# Altium schematic sheet CONNECTER.SchDoc
size 420 x 297 mm; SheetNumber: 4; SheetTotal: 4
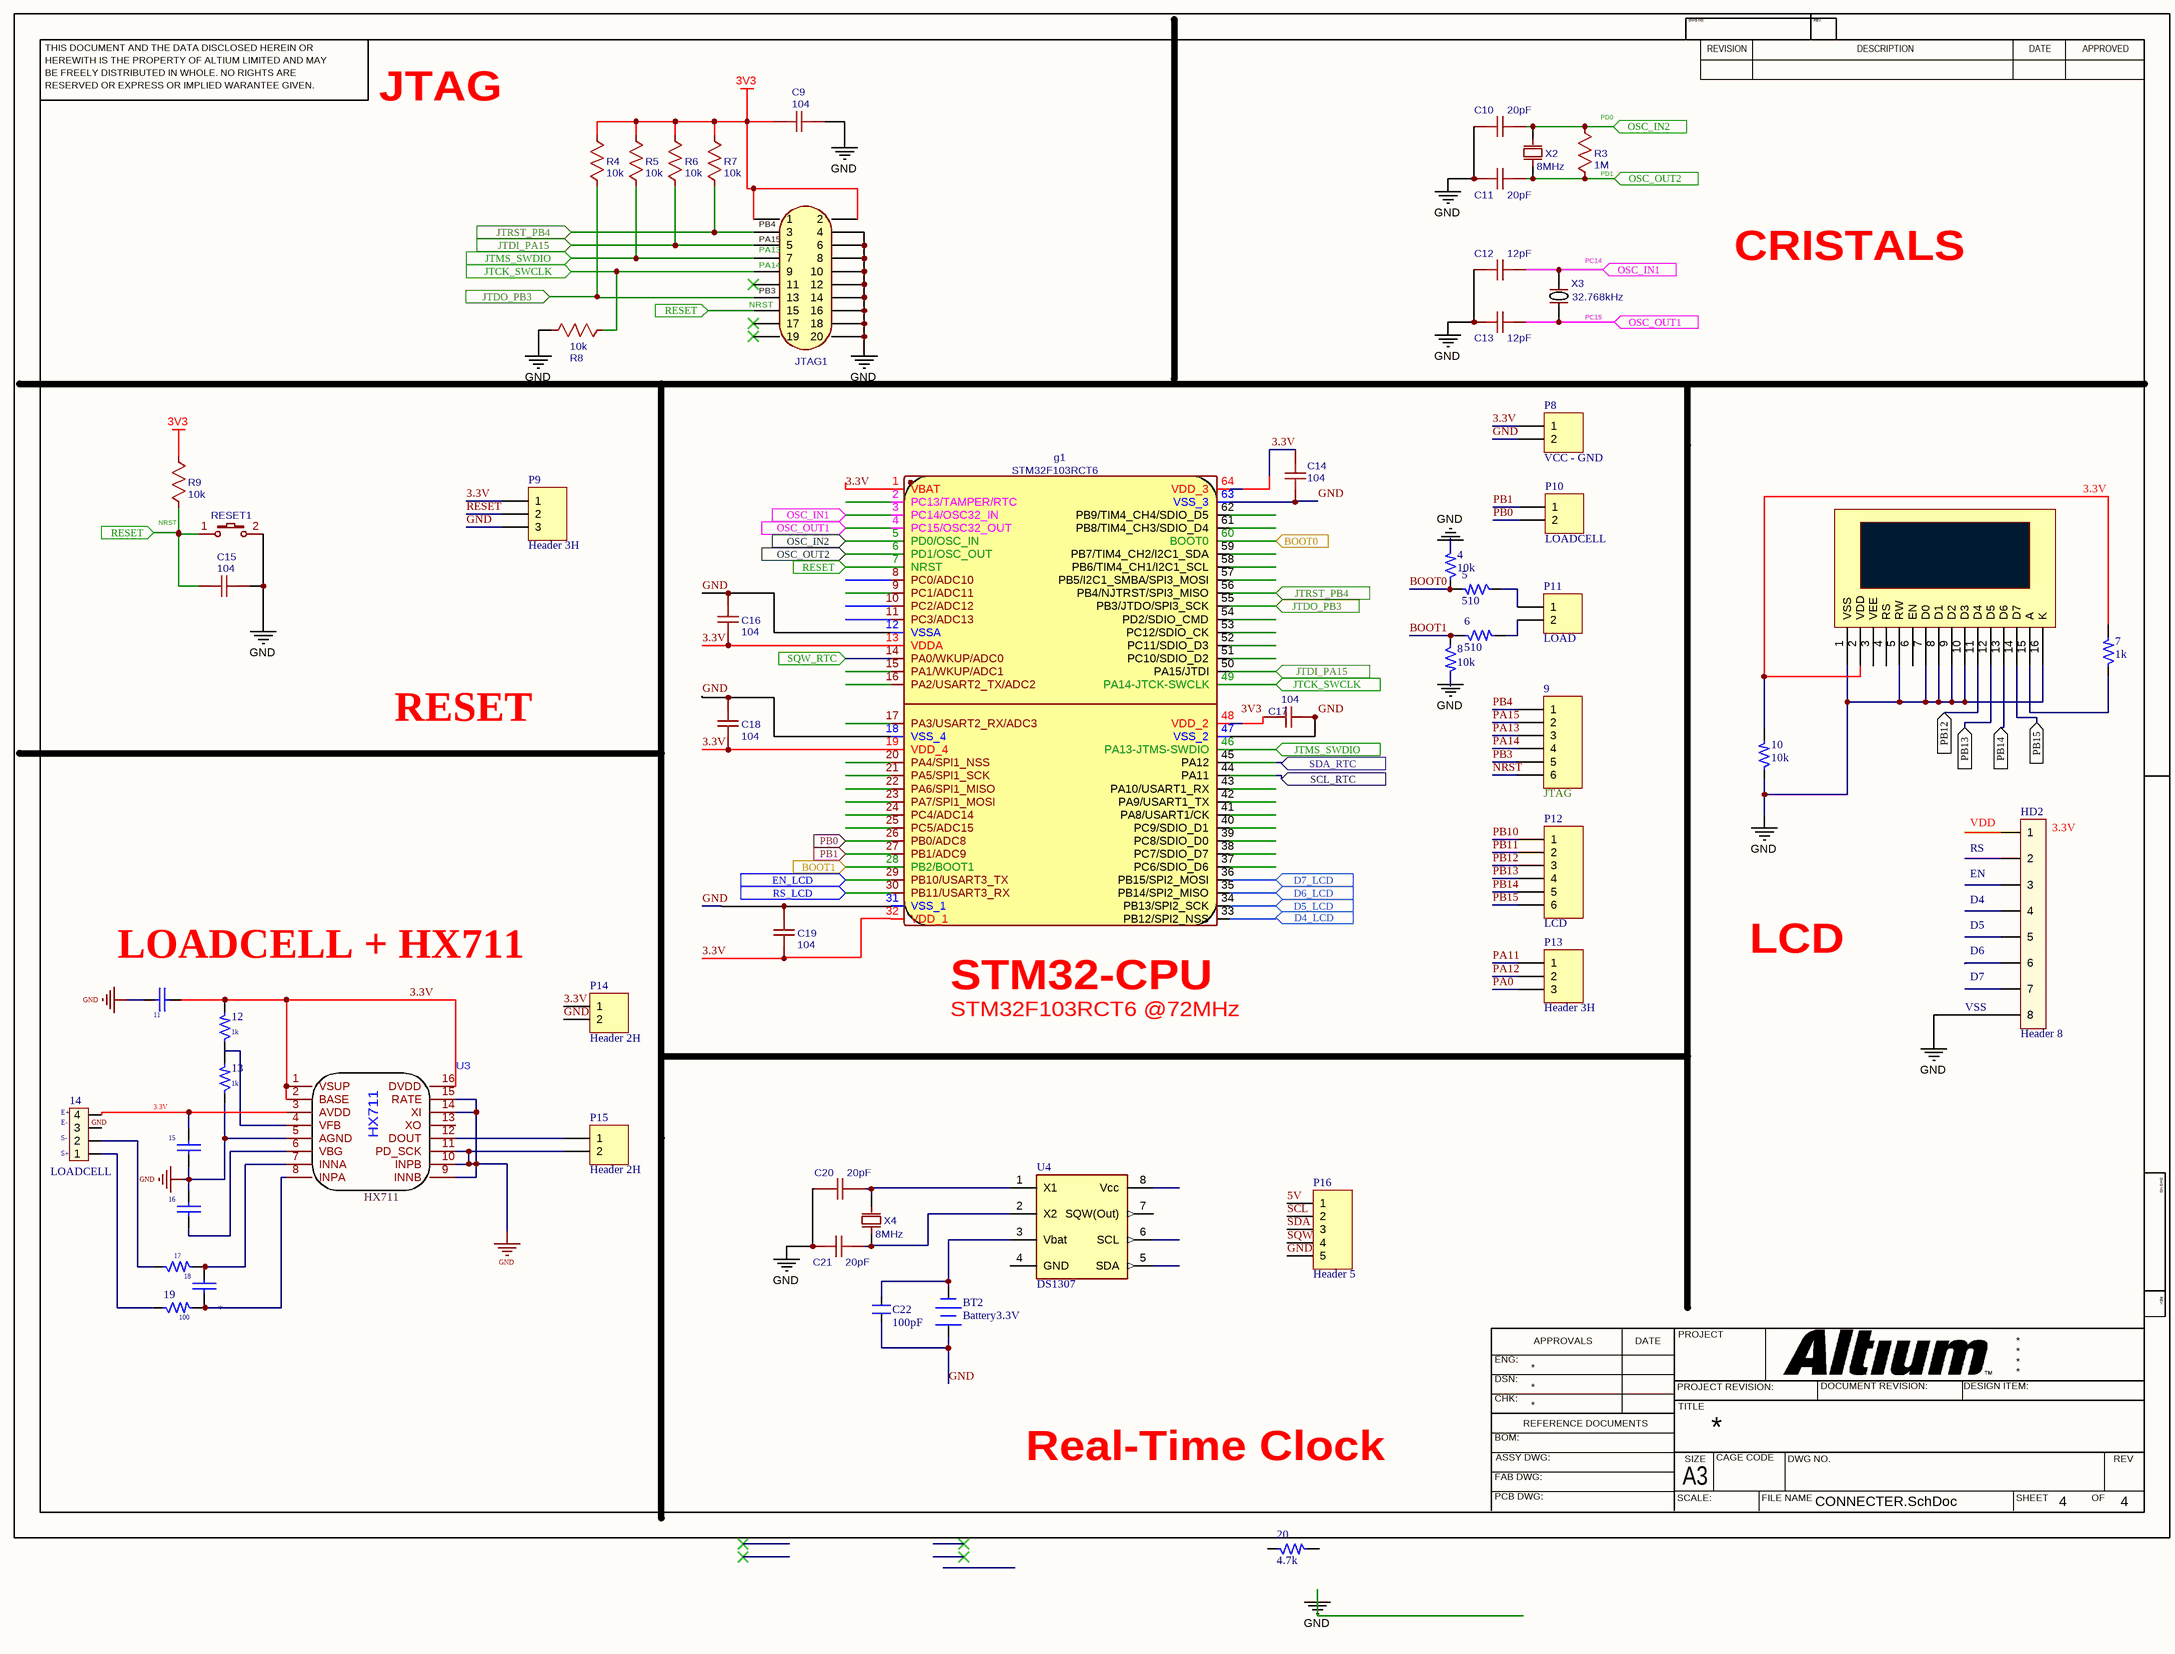
[diagram p0: CONNECTER.SchDoc]

## Parts
4  10k  [R1/6W]
5  510  [R1/6W]
6  510  [R1/6W]
7  1k  [R1/6W]
8  10k  [R1/6W]
9  JTAG  [HDR1X6]
10  10k  [R1/6W]
11  (no value)  [R1206]
12  1k  [R1/6W]
13  1k  [R1/6W]
14  LOADCELL  [JP4]
15  (no value)  [R1206]
16  (no value)  [R1206]
17  100  [R1/6W]
18  (no value)  [R1206]
19  (no value)  [R1/6W]
20  4.7k  [R1/6W]
?  LCD  [LCD16X2]  (value not drawn)
BT2  Battery3.3V  [CR2032 Holder]
C9  104  [C0603]
C10  20pF  [C0603]
C11  20pF  [C0603]
C12  12pF  [C0603]
C13  12pF  [C0603]
C14  104  [C0603]
C15  104  [C0603]
C16  104  [C0603]
C17  104  [C0603]
C18  104  [C0603]
C19  104  [C0603]
C20  20pF  [C0603]
C21  20pF  [C0603]
C22  100pF  [CN1]
g1  STM32F103RCT6  [STM32F103RCT6]
HD2  Header 8  [HED8V]
JTAG1  (no value)  [JTAG]
P8  VCC - GND  [HDR1X2H]
P9  Header 3H  [HDR1X3H]
P10  LOADCELL  [HDR1X2H]
P11  LOAD  [HDR1X2H]
P12  LCD  [HDR1X6]
P13  Header 3H  [HDR1X3H]
P14  Header 2H  [HDR1X2H]
P15  Header 2H  [HDR1X2H]
P16  Header 5
R3  1M  [R0603]
R4  10k  [R0603]
R5  10k  [R0603]
R6  10k  [R0603]
R7  10k  [R0603]
R8  10k  [R0603]
R9  10k  [R0603]
RESET1  K2-3.6×6.1_SMD  [KEY-SMD_L6.0-W3.5-LS8.0]  (value not drawn)
U3  (no value)  [SOP-16_L10.0-W3.9-P1.27-LS6.0-BL]
U4  DS1307  [DIP.100/8/W.300/L.400]
X2  8MHz  [HC-49SMD]
X3  32.768kHz  [CRYSTAL-TH_BD3.1-L8.0-P2.00-1]
X4  8MHz  [HC-49SMD]

## Ports
BOOT0 (in), BOOT1 (in), D4_LCD (in), D5_LCD (in), D6_LCD (in), D7_LCD (in), EN_LCD (in), JTCK_SWCLK (in), JTDI_PA15 (in), JTDO_PB3 (in), JTMS_SWDIO (in), JTRST_PB4 (in), OSC_IN1 (in), OSC_IN2 (in), OSC_OUT1 (in), OSC_OUT2 (in), PB0 (in), PB1 (in), PB12 (in), PB13 (in), PB14 (in), PB15 (in), RESET (in), RS_LCD (in), SCL_RTC (in), SDA_RTC (in), SQW_RTC (in)

## Nets
3V3: C9.1 JTAG1.1 JTAG1.2 R4.2 R5.2 R6.2 R7.2 R9.2
GND: 4.2 8.2 10.1 11.1 13.1 15.2 16.1 ?.1(VSS) ?.5(RW) ?.7(D0) ?.8(D1) ?.9(D2) ?.10(D3) ?.16(K) BT2.1(+) C9.2 C10.1 C11.1 C12.1 C13.1 C14.1 C15.2 C16.2 C17.2 C18.2 C19.2 C20.1 C21.1 C22.1 g1.12(VSSA) g1.18(VSS_4) g1.31(VSS_1) g1.47(VSS_2) g1.63(VSS_3) HD2.8 JTAG1.4 JTAG1.6 JTAG1.8 JTAG1.10 JTAG1.12 JTAG1.14 JTAG1.16 JTAG1.18 JTAG1.20 P8.2 P9.3 P14.2 P15.2 P16.5 R8.1 RESET1.2 U3.5(AGND) U3.9(INNB) U3.10(INPB) U3.11(PD_SCK) U3.14(XI) U3.15(RATE)
3.3V: 11.2 12.2 C14.2 C16.1 C18.1 C19.1 g1.1(VBAT) g1.13(VDDA) g1.19(VDD_4) g1.32(VDD_1) g1.64(VDD_3) P8.1 P9.1 P14.1 U3.1(VSUP) U3.2(BASE) U3.16(DVDD)
5V: P16.1
BOOT0: g1.60(BOOT0) ; port BOOT0
BOOT0: 4.1 5.2  [a separate net that carries the same name]
BOOT1: g1.28(PB2/BOOT1) ; port BOOT1
BOOT1: 6.1 8.1  [a separate net that carries the same name]
D4_LCD: g1.33(PB12/SPI2_NSS) ; port D4_LCD
D5_LCD: g1.34(PB13/SPI2_SCK) ; port D5_LCD
D6_LCD: g1.35(PB14/SPI2_MISO) ; port D6_LCD
D7_LCD: g1.36(PB15/SPI2_MOSI) ; port D7_LCD
EN_LCD: g1.29(PB10/USART3_TX) ; port EN_LCD
JTCK_SWCLK: g1.49(PA14-JTCK-SWCLK) JTAG1.9 R8.2 ; port JTCK_SWCLK
JTDI_PA15: g1.50(PA15/JTDI) JTAG1.5 R6.1 ; port JTDI_PA15
JTDO_PB3: g1.55(PB3/JTDO/SPI3_SCK) JTAG1.13 R4.1 ; port JTDO_PB3
JTMS_SWDIO: g1.46(PA13-JTMS-SWDIO) JTAG1.7 R5.1 ; port JTMS_SWDIO
JTRST_PB4: g1.56(PB4/NJTRST/SPI3_MISO) JTAG1.3 R7.1 ; port JTRST_PB4
NRST: 9.6
OSC_IN1: C12.2 g1.3(PC14/OSC32_IN) X3.2(OSC2) ; port OSC_IN1
OSC_IN2: C10.2 g1.5(PD0/OSC_IN) R3.2 X2.1(OSC1) ; port OSC_IN2
OSC_OUT1: C13.2 g1.4(PC15/OSC32_OUT) X3.1(OSC1) ; port OSC_OUT1
OSC_OUT2: C11.2 g1.6(PD1/OSC_OUT) R3.1 X2.2(OSC2) ; port OSC_OUT2
PA0: P13.3
PA11: P13.1
PA12: P13.2
PA13: 9.3
PA14: 9.4
PA15: 9.2
PB0: g1.26(PB0/ADC8) ; port PB0
PB0: P10.2  [a separate net that carries the same name]
PB1: g1.27(PB1/ADC9) ; port PB1
PB1: P10.1  [a separate net that carries the same name]
PB3: 9.5
PB4: 9.1
PB10: P12.1
PB11: P12.2
PB12: ?.11(D4) ; port PB12
PB12: P12.3  [a separate net that carries the same name]
PB13: ?.12(D5) ; port PB13
PB13: P12.4  [a separate net that carries the same name]
PB14: ?.13(D6) ; port PB14
PB14: P12.5  [a separate net that carries the same name]
PB15: ?.14(D7) ; port PB15
PB15: P12.6  [a separate net that carries the same name]
RESET: C15.1 g1.7(NRST) JTAG1.15 R9.1 RESET1.1 ; port RESET
RESET: P9.2  [a separate net that carries the same name]
RS_LCD: g1.30(PB11/USART3_RX) ; port RS_LCD
SCL: P16.2
SCL_RTC: g1.44(PA11) ; port SCL_RTC
SDA : P16.3
SDA_RTC: g1.45(PA12) ; port SDA_RTC
SQW: P16.4
SQW_RTC: g1.14(PA0/WKUP/ADC0) ; port SQW_RTC
Net5_1: 5.1 P11.1
Net6_2: 6.2 P11.2
Net7_1: 7.1 ?.15(A)
Net7_2: 7.2 10.2 ?.2(VDD)
Net13_2: 13.2 U3.4(VFB)
Net14_1: 14.1 19.1
Net14_2: 14.2 17.1
Net14_4: 14.4 15.1 U3.3(AVDD)
Net16_2: 16.2 U3.6(VBG)
Net17_2: 17.2 18.1 U3.7(INNA)
Net18_2: 18.2 19.2 U3.8(INPA)
NetBT2_2: BT2.2(-) C22.2 U4.3(Vbat)
NetC17_1: C17.1 g1.48(VDD_2)
NetC20_2: C20.2 U4.1(X1) X4.1(OSC1)
NetC21_2: C21.2 U4.2(X2) X4.2(OSC2)
NetP15_1: P15.1 U3.12(DOUT)

Not connected (* = marked no-connect by the designer): 12 1; 14 3; 20 1 2; ? 3(VEE) 4(RS) 6(EN); g1 2(PC13/TAMPER/RTC) 8(PC0/ADC10) 9(PC1/ADC11) 10(PC2/ADC12) 11(PC3/ADC13) 15(PA1/WKUP/ADC1) 16(PA2/USART2_TX/ADC2) 17(PA3/USART2_RX/ADC3) 20(PA4/SPI1_NSS) 21(PA5/SPI1_SCK) 22(PA6/SPI1_MISO) 23(PA7/SPI1_MOSI) 24(PC4/ADC14) 25(PC5/ADC15) 37(PC6/SDIO_D6) 38(PC7/SDIO_D7) 39(PC8/SDIO_D0) 40(PC9/SDIO_D1) 41(PA8/USART1/CK) 42(PA9/USART1_TX) 43(PA10/USART1_RX) 51(PC10/SDIO_D2) 52(PC11/SDIO_D3) 53(PC12/SDIO_CK) 54(PD2/SDIO_CMD) 57(PB5/I2C1_SMBA/SPI3_MOSI) 58(PB6/TIM4_CH1/I2C1_SCL) 59(PB7/TIM4_CH2/I2C1_SDA) 61(PB8/TIM4_CH3/SDIO_D4) 62(PB9/TIM4_CH4/SDIO_D5); HD2 1 2 3 4 5 6 7; JTAG1 11* 17* 19*; U3 13(XO); U4 4(GND) 5(SDA) 6(SCL) 7(SQW(Out)) 8(Vcc)

## Notes on the sheet
- JTAG
- (near R3) PD0
- (near R3) PD1
- (near JTAG1) PA13
- (near JTAG1) PB4
- (near JTAG1) PA15
- (near X3) PC14
- (near JTAG1) NRST
- (near JTAG1) PA14
- (near JTAG1) PB3
- (near X3) PC15
- CRISTALS
- (near R9) NRST
- PC14
- 3.3V
- PC15
- RESET
- (near HD2) VDD
- (near HD2) 3.3V
- (near HD2) RS
- (near HD2) EN
- (near HD2) D4
- LOADCELL + HX711
- LCD
- (near HD2) D5
- (near HD2) D6
- (near g1) STM32-CPU
- STM32F103RCT6 @72MHz
- (near HD2) VSS
- (near HD2) D7
- (near 15) 3.3V
- (near 14) E+
- (near 14) E-
- (near 14) S-
- (near 14) S+
- (near 14) GND
- (near U3) HX711
- Real-Time Clock
- Labels drawn without touching a wire or pin: 3V3
- THIS DOCUMENT AND THE DATA DISCLOSED HEREIN OR
- HEREWITH IS THE PROPERTY OF ALTIUM LIMITED AND MAY
- DWG NO:
- REVISION
- REV:
- DESCRIPTION
- DATE
- APPROVED
- BE FREELY DISTRIBUTED IN WHOLE. NO RIGHTS ARE
- RESERVED OR EXPRESS OR IMPLIED WARANTEE GIVEN.
- ENG:
- APPROVALS
- PROJECT
- DSN:
- CHK:
- REFERENCE DOCUMENTS
- PROJECT REVISION:
- TITLE
- DOCUMENT REVISION:
- DESIGN ITEM:
- BOM:
- FAB DWG:
- PCB DWG:
- ASSY DWG:
- SCALE:
- A3
- SIZE
- CAGE CODE
- FILE NAME
- DWG NO.
- SHEET
- OF
- REV

## Library data of the parts
4-8 10 12 13 17 19 20 = Res: Resistor 1/4W; Value: R1/4W - 1K
9 P12 = Header 6: Header, 6-Pin; LatestRevisionDate: 17-Jul-2002; LatestRevisionNote: Re-released for DXP Platform.; Publisher: Altium Limited
11 15 16 18 = CAP: Capacitor
  18: Footprint: *
14 = JP4: JP4 PIN; Value: JP4
? = LCD: Value: LCD16x2
BT2 = Battery3.3V: Multicell Battery; Published: 24-Mar-1999; LatestRevisionDate: 17-Jul-2002; LatestRevisionNote: Re-released for DXP Platform.; PackageReference: BAT-2; Publisher: Altium Limited
C9 C14-C19 = 104: nameAlias: Value(F); Contributor: LCEDA_Lib; spicePre: C; spiceSymbolName: C_1206_US
C10 C11 C20 C21 = 20pF: BOM_Manufacturer: FH; BOM_Manufacturer Part: 0603CG200J500NT; nameAlias: Capacitance; BOM_Supplier: LCSC; BOM_Supplier Part: C91702; spicePre: C; spiceSymbolName: 0603CG200J500NT
C12 C13 = 12pF: BOM_Manufacturer: FH; BOM_Manufacturer Part: 0603CG200J500NT; nameAlias: Capacitance; BOM_Supplier: LCSC; BOM_Supplier Part: C91702; spicePre: C; spiceSymbolName: 0603CG200J500NT
C22 = CN1: Cap np  1pF - 472pF; Value: 100pF
g1 = STM32F103RCT6: BOM_Manufacturer: ST(意法半导体); Contributor: wegi1; BOM_Supplier: LCSC; BOM_Manufacturer Part: STM32F103RCT6; BOM_Supplier Part: C8318; BOM_JLCPCB Part Class: Extended Part; spicePre: U; spiceSymbolName: STM32F103RCT6
HD2 = Header 8: Header 8 Vit Broad
JTAG1 = Header 10X2: spicePre: J; spiceSymbolName: Header 10X2
P8 P10 P11 P14 P15 = Header 2H: Header, 2-Pin, Right Angle; LatestRevisionDate: 17-Jul-2002; LatestRevisionNote: Re-released for DXP Platform.; Publisher: Altium Limited
P9 P13 = Header 3H: Header, 3-Pin, Right Angle; LatestRevisionDate: 17-Jul-2002; LatestRevisionNote: Re-released for DXP Platform.; Publisher: Altium Limited
P16 = Header 5: Header, 5-Pin; LatestRevisionDate: 17-Jul-2002; LatestRevisionNote: Re-released for DXP Platform.; Publisher: Altium Limited
R3 = 1M: nameAlias: Value(Ω); Contributor: LCEDA_Lib; spicePre: R; spiceSymbolName: R_0805_US
R4-R9 = 10k: nameAlias: Value(Ω); Contributor: LCEDA_Lib; spicePre: R; spiceSymbolName: R_0805_US
RESET1 = K2-3.6×6.1_SMD: BOM_Manufacturer Part: K2-1107ST-A4SW-06; Contributor: LCEDA_Lib; 制造商: 韩国韩荣; BOM_Supplier Part: C118141; BOM_Supplier: LCSC; spicePre: K; spiceSymbolName: K2-3.6×6.1_SMD
U3 = HX711
U4 = DS1307: 64 X 8 Serial Real-Time Clock
X2 X4 = 8MHz: BOM_Manufacturer: TAE; BOM_Manufacturer Part: HC-49SM8MHz20pF30ppm; nameAlias: Frequency; Contributor: T. Ruiz; BOM_Supplier: LCSC; BOM_Supplier Part: C107426; spicePre: X; spiceSymbolName: HC-49SM8MHz20pF30ppm
X3 = 32.768kHz: BOM_Manufacturer: HD(浩都频率); BOM_Manufacturer Part: 7Q032768NW2; Contributor: LCSC; nameAlias: Frequency; BOM_Supplier: LCSC; BOM_Supplier Part: C655213; BOM_JLCPCB Part Class: Extended Part; spicePre: X; spiceSymbolName: 7Q032768NW2